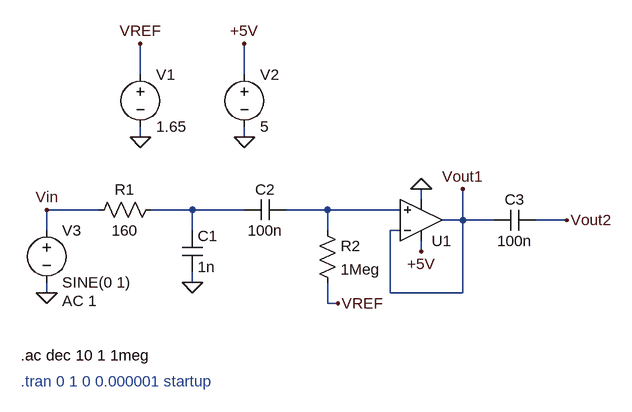
[diagram p0: schematic Draft12.asc]
Draft12.asc, the LTspice schematic file:
Version 4.1
SHEET 1 880 680
WIRE 48 -144 48 -192
WIRE 208 -144 208 -192
WIRE 48 -48 48 -64
WIRE 208 -48 208 -64
WIRE 480 48 480 32
WIRE -16 64 -96 64
WIRE 128 64 64 64
WIRE 208 64 128 64
WIRE 336 64 272 64
WIRE 448 64 336 64
WIRE 544 80 544 32
WIRE 544 80 512 80
WIRE 592 80 544 80
WIRE 704 80 656 80
WIRE -96 96 -96 64
WIRE 128 96 128 64
WIRE 336 96 336 64
WIRE 448 96 432 96
WIRE 480 128 480 112
WIRE 128 176 128 160
WIRE -96 192 -96 176
WIRE 432 192 432 96
WIRE 544 192 544 80
WIRE 544 192 432 192
WIRE 336 208 336 176
WIRE 352 208 336 208
FLAG 128 176 0
FLAG 48 -48 0
FLAG 208 -48 0
FLAG 208 -192 +5V
FLAG 48 -192 VREF
FLAG 480 128 +5V
FLAG 480 32 0
FLAG 352 208 VREF
FLAG 704 80 Vout2
FLAG 544 32 Vout1
FLAG -96 192 0
FLAG -96 64 Vin
SYMBOL res 80 48 R90
WINDOW 0 0 56 VBottom 2
WINDOW 3 32 56 VTop 2
SYMATTR InstName R1
SYMATTR Value 160
SYMBOL cap 112 96 R0
SYMATTR InstName C1
SYMATTR Value 1n
SYMBOL cap 272 48 R90
WINDOW 0 0 32 VBottom 2
WINDOW 3 32 32 VTop 2
SYMATTR InstName C2
SYMATTR Value 100n
SYMBOL res 320 80 R0
SYMATTR InstName R2
SYMATTR Value 1Meg
SYMBOL OpAmps\\UniversalOpAmp 480 80 M180
SYMATTR InstName U1
SYMBOL voltage 48 -160 R0
WINDOW 123 0 0 Left 0
WINDOW 39 0 0 Left 0
SYMATTR InstName V1
SYMATTR Value 1.65
SYMBOL voltage 208 -160 R0
WINDOW 123 0 0 Left 0
WINDOW 39 0 0 Left 0
SYMATTR InstName V2
SYMATTR Value 5
SYMBOL cap 656 64 R90
WINDOW 0 0 32 VBottom 2
WINDOW 3 32 32 VTop 2
SYMATTR InstName C3
SYMATTR Value 100n
SYMBOL voltage -96 80 R0
WINDOW 123 24 124 Left 2
WINDOW 39 0 0 Left 0
SYMATTR InstName V3
SYMATTR Value SINE(0 1)
SYMATTR Value2 AC 1
TEXT -136 288 Left 2 !.ac dec 10 1 1meg
TEXT -136 328 Left 2 ;.tran 0 1 0 0.000001 startup

The netlist it stands for:
* Draft12.asc
R1 N001 Vin 160
C1 N001 0 1n
C2 N002 N001 100n
R2 N002 VREF 1Meg
X§U1 N002 Vout1 +5V 0 Vout1 level1 Avol=1Meg GBW=10Meg Vos=0 En=0 Enk=0 In=0 Ink=0 Rin=500Meg  ; pins In+ In- V+ V- OUT
V1 VREF 0 1.65
V2 +5V 0 5
C3 Vout2 Vout1 100n
V3 Vin 0 SINE(0 1) AC 1
.ac dec 10 1 1meg
* .tran 0 1 0 0.000001 startup
.lib UniversalOpAmp1.lib
.backanno
.end